# EAGLE design Timer PCB (EAGLE 6.5.0)
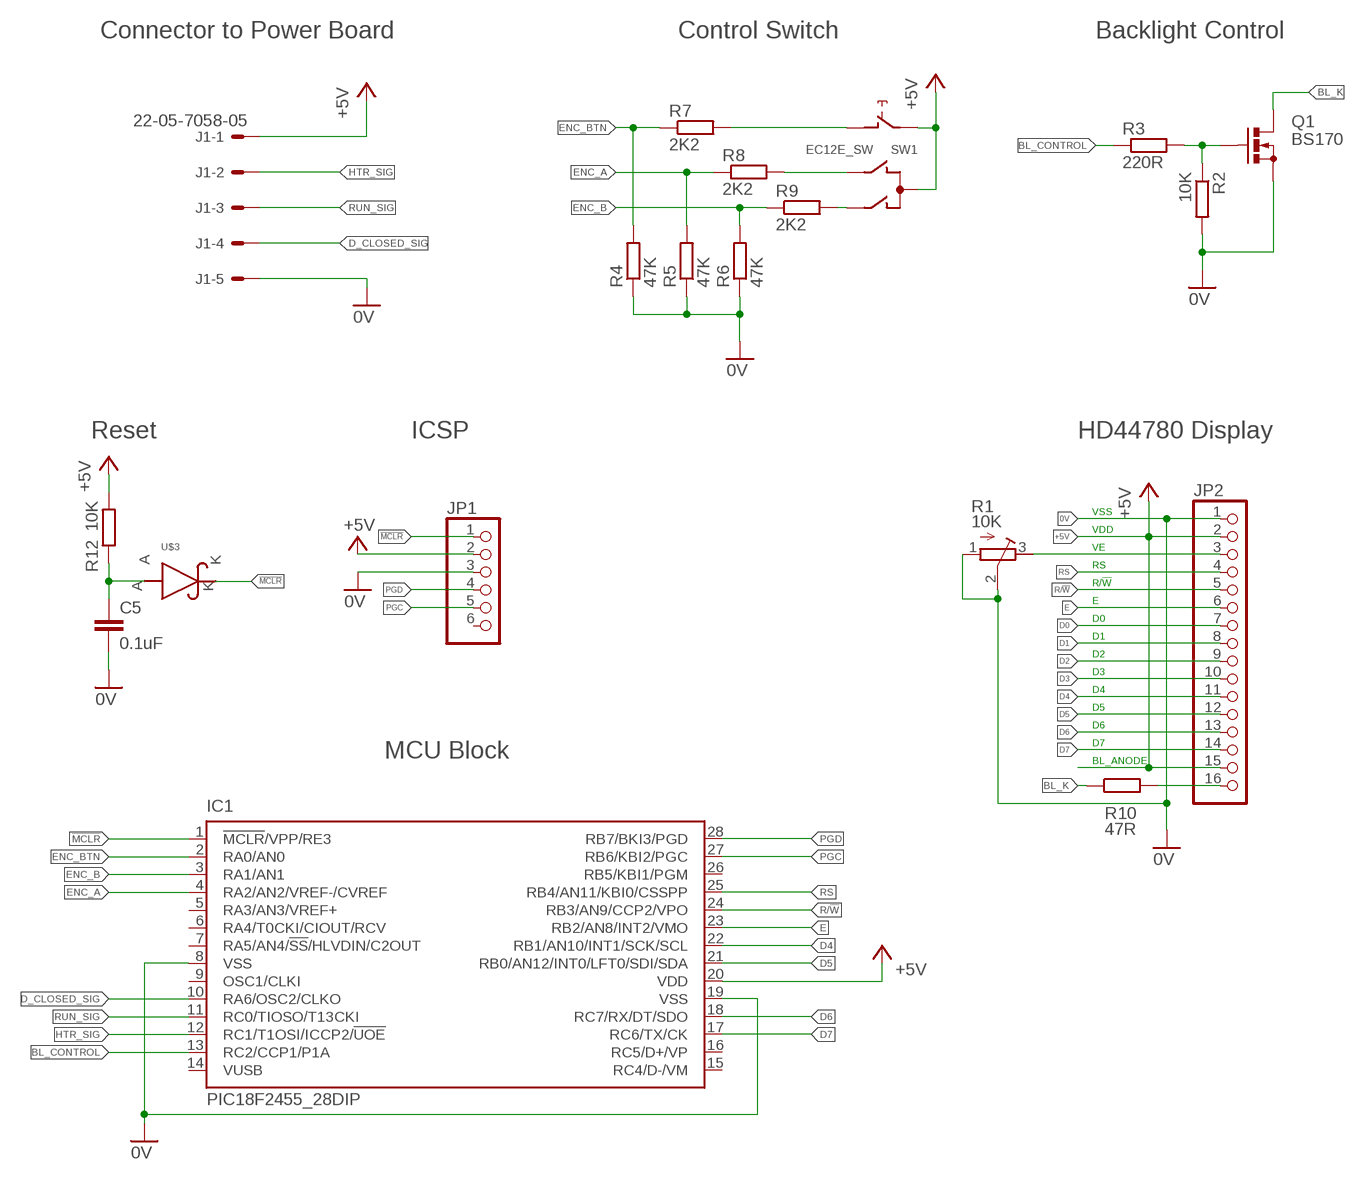
[diagram p0: schematic, sheet 1]

## Parts
C5  0.1uF  C-EUC0603  [C0603]
IC1  PIC18F2455_28DIP  [DIL28-3]
J1  22-05-7058-05  [7395-05]
JP1  PINHD-1X6/90  [1X06/90]
JP2  PINHD-1X16  [1X16]
Q1  BS170  [SOT54E]
R1  10K  R-TRIMM64W  [RTRIM64W]
R2  10K  R-EU_R0805  [R0805]
R3  220R  R-EU_R0805  [R0805]
R4  47K  R-EU_R0805  [R0805]
R5  47K  R-EU_R0805  [R0805]
R6  47K  R-EU_R0805  [R0805]
R7  2K2  R-EU_R0805  [R0805]
R8  2K2  R-EU_R0805  [R0805]
R9  2K2  R-EU_R0805  [R0805]
R10  47R  R-EU_0309/12  [0309/12]
R12  10K  R-EU_R0603  [R0603]
SW1  EC12E_SW  [ALPS_EC12E_SW]
U$3  ZHCS750  [SOT23]

## Nets
0V [power]: C5.2 IC1.8(VSS) IC1.19(VSS) J1.5 JP1.3 JP2.1 Q1.S R1.1(E) R1.2(S) R2.2 R4.1 R5.1 R6.1
!MCLR: IC1.1(!MCLR!/VPP/RE3) JP1.1 U$3.K
+5V [power]: IC1.20(VDD) J1.1 JP1.2 JP2.2 JP2.15 R12.2 SW1.C SW1.E
BL_CONTROL: IC1.13(RC2/CCP1/P1A) R3.1
BL_K [power]: Q1.D R10.1
D0: JP2.7
D1: JP2.8
D2: JP2.9
D3: JP2.10
D4: IC1.22(RB1/AN10/INT1/SCK/SCL) JP2.11
D5: IC1.21(RB0/AN12/INT0/LFT0/SDI/SDA) JP2.12
D6: IC1.18(RC7/RX/DT/SDO) JP2.13
D7: IC1.17(RC6/TX/CK) JP2.14
D_CLOSED_SIG: IC1.10(RA6/OSC2/CLKO) J1.4
E: IC1.23(RB2/AN8/INT2/VMO) JP2.6
ENC_A: IC1.4(RA2/AN2/VREF-/CVREF) R5.2 R8.1
ENC_B: IC1.3(RA1/AN1) R6.2 R9.1
ENC_BTN: IC1.2(RA0/AN0) R4.2 R7.1
HTR_SIG: IC1.12(RC1/T1OSI/ICCP2/!UOE) J1.2
N$1: Q1.G R2.1 R3.2
N$4 [power]: JP2.3 R1.3(A)
N$5: R8.2 SW1.B
N$6: R7.2 SW1.D
N$7: R9.2 SW1.A
N$9: JP2.16 R10.2
N$33: C5.1 R12.1 U$3.A
PGC: IC1.27(RB6/KBI2/PGC) JP1.5
PGD: IC1.28(RB7/BKI3/PGD) JP1.4
R/!W: IC1.24(RB3/AN9/CCP2/VPO) JP2.5
RS: IC1.25(RB4/AN11/KBI0/CSSPP) JP2.4
RUN_SIG: IC1.11(RC0/TIOSO/T13CKI) J1.3
Unconnected: IC1.5(RA3/AN3/VREF+) IC1.6(RA4/T0CKI/CIOUT/RCV) IC1.7(RA5/AN4/!SS!/HLVDIN/C2OUT) IC1.9(OSC1/CLKI) IC1.14(VUSB) IC1.15(RC4/D-/VM) IC1.16(RC5/D+/VP) IC1.26(RB5/KBI1/PGM) JP1.6 SW1.GND1(G) SW1.GND2(G)

## Notes on the sheet
- Connector to Power Board | Control Switch | Backlight Control
- Reset | ICSP | HD44780 Display
- VSS
- VDD
- VE
- RS
- R/!W
- E
- D0
- D1
- D2
- D3
- D4
- D5
- D6
- D7
- MCU Block
- BL_ANODE

## Library data of the parts
C5 = rcl:C-EU: CAPACITOR, European symbol
IC1 = microchip:PIC18F2*_28: USB Microcontrollers with nanoWatt Technology High-Performance, Enhanced Flash, 28/40/44-Pin, Source: http://ww1.microchip.com/downloads/en/devicedoc/39632c.pdf; MF: MICROCHIP; MPN: PIC18F2455-I/SP; OC_FARNELL: 1579600; OC_NEWARK: 01M8485
J1 = con-molex:22-?-05: CONNECTOR wire to board 2.54 mm (.1 inch) pitch header; OC_FARNELL: unknown; OC_NEWARK: unknown
JP1 = pinhead:PINHD-1X6: PIN HEADER
JP2 = pinhead:PINHD-1X16: PIN HEADER
Q1 = transistor-small-signal:BS170: N-CHANNEL MOS FET
R1 = rcl:R-TRIMM: Trimm resistor
R2-R10 R12 = rcl:R-EU_: RESISTOR, European symbol
SW1 = switch-alps:EC12E_SW: ALPS rotary Encoder EC12E series with switch; MPN: EC12E2424407; OC_FARNELL: 1520813; OC_NEWARK: 74M1068
U$3 = Duncs Diodes:ZHCS750: ZHCS750 750mA Schottky signal diode in a SOT-23 package. See datasheet for further information.

## Net classes
0 signal: width 0.406 mm, clearance 0.305 mm
1 power: width 1.016 mm, clearance 0.305 mm

## Board
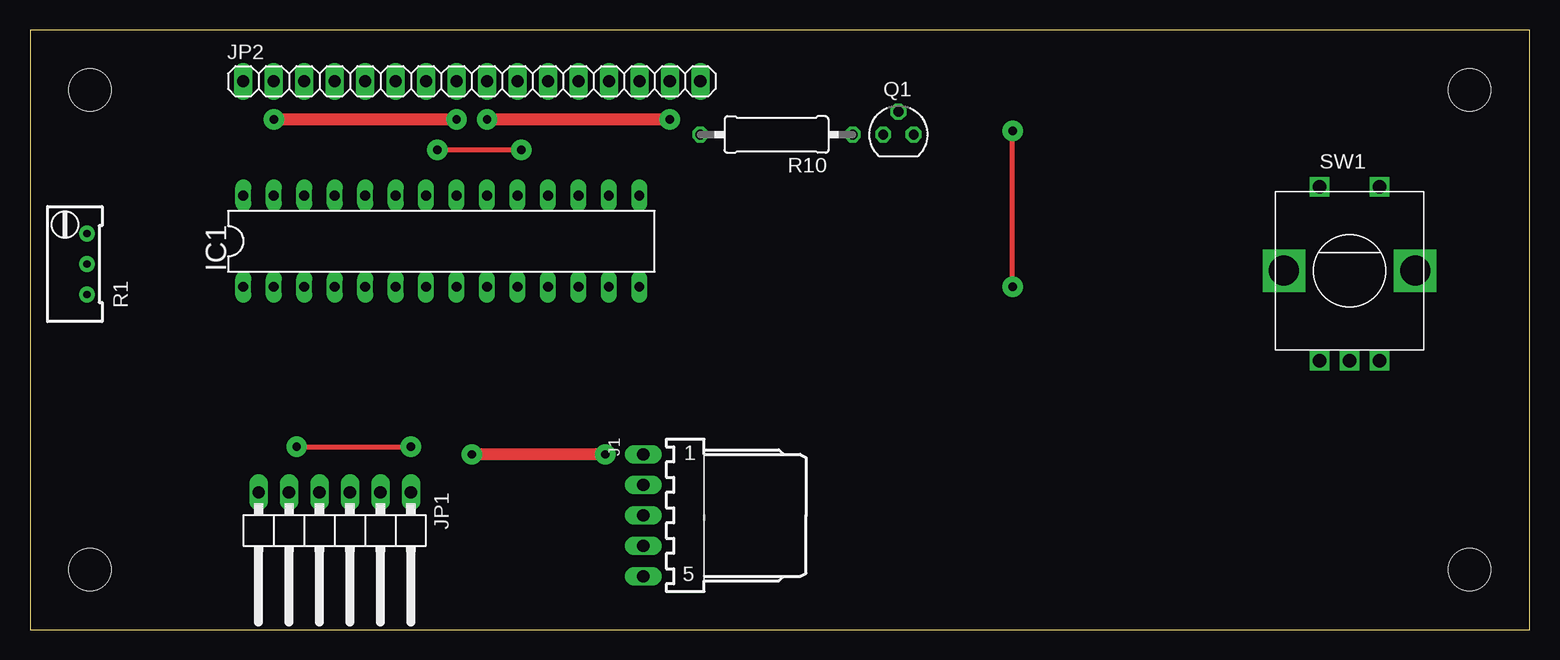
[diagram p1: board, top side]
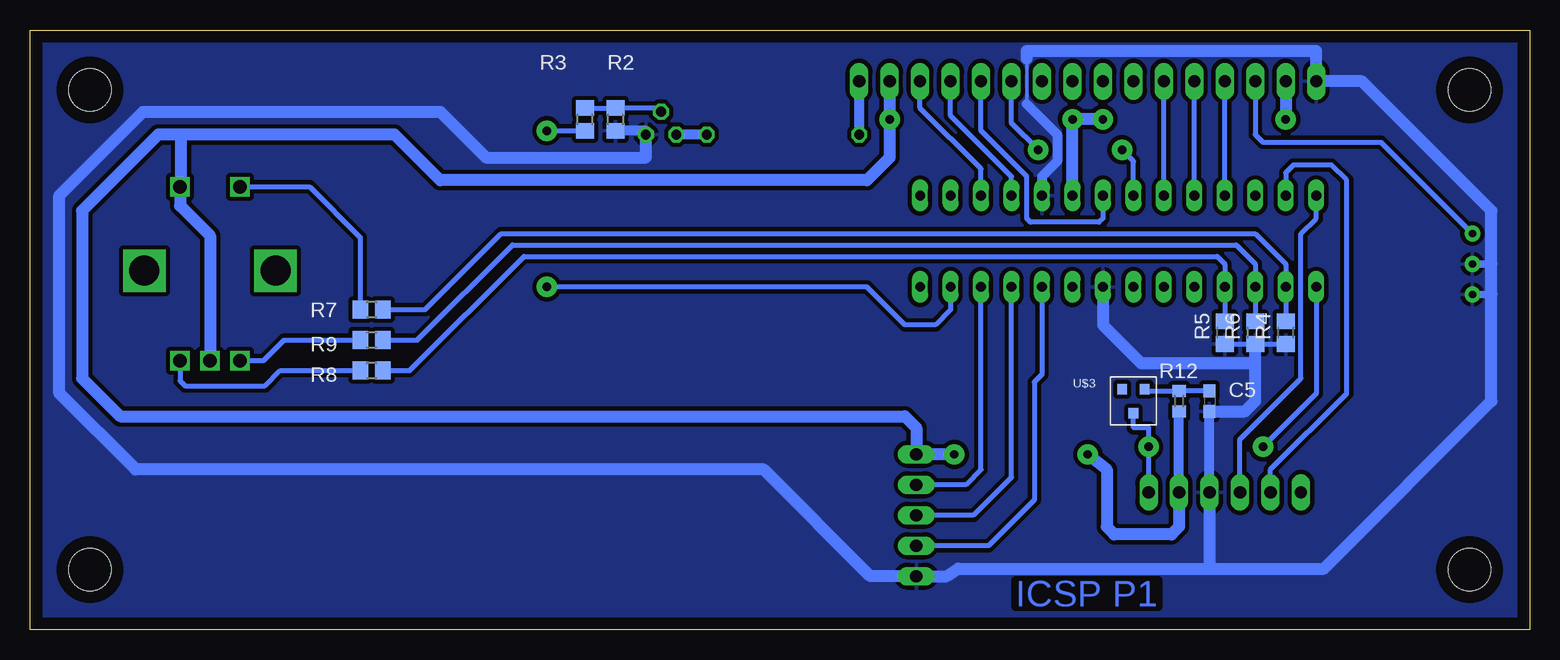
[diagram p2: board, bottom side, seen from below]

Size 125 x 50 mm. Coordinates in mm from the lower left corner, seen from the top.
Outline: 0,0 125,0 125,50 0,50 0,0
Copper layers (1*16): Top 0.035mm / dielectric 1.5mm / Bottom 0.035mm
Design rules "default *": minimum track width 10mil, minimum drill 24mil, track to track 8mil, track to pad 8mil, pad to pad 8mil, via to via 8mil, smd to smd 8mil, copper to edge 40mil, drill to drill 8mil, minimum pad ring 10mil, minimum via ring 8mil, stop-mask expansion 4mil, vias tented up to drill 0mil, thermal gap 14mil
Holes 3.5 mm at 5,5 120,5 5,45 120,45

### Footprints (pad centres in the part's own frame; a part is rotated, then mirrored left to right if it is on the bottom)
C0603 = smd 1.1 x 1: 1 -0.85,0; 2 0.85,0
DIL28-3 = drill 0.813 long: 1 -16.51,-3.81; 2 -13.97,-3.81; 3 -11.43,-3.81; 4 -8.89,-3.81; 5 -6.35,-3.81; 6 -3.81,-3.81; 7 -1.27,-3.81; 8 1.27,-3.81; 9 3.81,-3.81; 10 6.35,-3.81; 11 8.89,-3.81; 12 11.43,-3.81; 13 13.97,-3.81; 14 16.51,-3.81; 15 16.51,3.81; 16 13.97,3.81; 17 11.43,3.81; 18 8.89,3.81; 19 6.35,3.81; 20 3.81,3.81; 21 1.27,3.81; 22 -1.27,3.81; 23 -3.81,3.81; 24 -6.35,3.81; 25 -8.89,3.81; 26 -11.43,3.81; 27 -13.97,3.81; 28 -16.51,3.81
7395-05 = drill 1.016 long: 1 5.08,0; 2 2.54,0; 3 0,0; 4 -2.54,0; 5 -5.08,0
1X06/90 = drill 1.016 long: 1 -6.35,-3.81; 2 -3.81,-3.81; 3 -1.27,-3.81; 4 1.27,-3.81; 5 3.81,-3.81; 6 6.35,-3.81
1X16 = drill 1.016 long: 1 -19.05,0; 2 -16.51,0; 3 -13.97,0; 4 -11.43,0; 5 -8.89,0; 6 -6.35,0; 7 -3.81,0; 8 -1.27,0; 9 1.27,0; 10 3.81,0; 11 6.35,0; 12 8.89,0; 13 11.43,0; 14 13.97,0; 15 16.51,0; 16 19.05,0
SOT54E = drill 0.813 octagon: D -1.27,0; G 0,1.905; S 1.27,0
RTRIM64W = drill 0.61 pad 1.3: 1 1.27,-2.54; 2 1.27,0; 3 1.27,2.54
R0805 = smd 1.3 x 1.5: 1 -0.95,0; 2 0.95,0
0309/12 = drill 0.813 octagon: 1 -6.35,0; 2 6.35,0
R0603 = smd 1 x 1.1: 1 -0.85,0; 2 0.85,0
ALPS_EC12E_SW = drill 1.1 square: A -2.5,-7.5; B 2.5,-7.5; C 0,-7.5; D -2.5,7; E 2.5,7 | drill 2.5 square: GND1 -5.465,0; GND2 5.465,0
SOT23 = smd 0.8 x 0.9: A -0.95,-1; K 0,1; NC 0.95,-1

### Placement (x,y rotation side)
C5  26.67,19.05 270 bottom
IC1  34.29,32.38 0 top
J1  51.12,9.53 90 top
JP1  25.4,7.62 180 top
JP2  36.83,45.72 0 top
Q1  72.39,41.27 0 top
R1  3.49,30.48 0 top
R2  76.2,42.55 270 bottom
R3  78.74,42.55 90 bottom
R4  20.32,24.77 90 bottom
R5  25.4,24.77 90 bottom
R6  22.86,24.77 90 bottom
R7  96.52,26.67 180 bottom
R8  96.52,21.59 180 bottom
R9  96.52,24.13 180 bottom
R10  62.23,41.27 180 top
R12  29.21,19.05 270 bottom
SW1  110,29.92 0 top
U$3  33.02,19.05 180 bottom

### Tracks (layer width: path | path; a pad name or v marks a point on that pad's centre or on a via)
0V
  Bottom 0.305: 41.91,43.81 41.91,47.62
  Bottom 0.406: R5.1 R6.1 R4.1
  Bottom 0.61: R1.2 3.17,30.48 | R1.1 3.17,27.94
  Bottom 0.813: JP1.3 C5.2 | Q1.S 73.66,41.59 R2.2 | 41.91,43.81 39.37,41.27 39.37,39.05 40.64,37.78 IC1.19
  Bottom 1.016: 26.67,5.08 47.62,5.08 48.58,4.45 J1.5 54.93,4.45 63.82,13.34 116.2,13.34 122.56,19.68 122.56,36.2 115.57,43.18 90.81,43.18 87,39.37 73.66,39.37 Q1.S | 26.67,5.08 17.14,5.08 3.17,19.05 3.17,27.94 3.17,30.48 3.17,34.92 13.97,45.72 JP2.1 17.78,48.26 41.91,48.26 41.91,47.62 | C5.2 23.71,18.2 22.86,19.05 22.86,22.23 | 22.86,22.23 R6.1 | IC1.8 35.56,25.4 32.38,22.23 22.86,22.23 | JP1.3 26.67,5.08
  pour Bottom (isolate 0.356): -0.32,50.8 125.73,50.8 125.73,-0.95 -0.32,-0.95
!MCLR  (via drill 0.7 pad 1.7)
  Top 0.406: v22.23,15.24 v31.75,15.24
  Bottom 0.406: JP1.1 v31.75,15.24 31.75,16.83 33.02,16.83 U$3.K | IC1.1 17.78,19.68 v22.23,15.24
+5V  (via drill 0.7 pad 1.7)
  Top 1.016: v20.32,42.55 v35.56,42.55 | v38.1,42.55 v53.34,42.55 | v47.94,14.61 v36.83,14.61
  Bottom 0.813: JP1.2 R12.2
  Bottom 1.016: JP2.2 v20.32,42.55 | v35.56,42.55 v38.1,42.55 IC1.20 | JP1.2 29.21,8.57 29.84,7.94 34.61,7.94 35.24,8.57 35.24,13.34 v36.83,14.61 | 112.39,41.27 94.61,41.27 90.81,37.47 55.24,37.47 53.34,39.37 v53.34,42.55 JP2.15 | 112.39,41.27 114.3,41.27 120.65,34.92 120.65,20.95 117.47,17.78 52.07,17.78 51.12,16.83 J1.1 v47.94,14.61 | SW1.C 110,32.85 112.5,35.35 SW1.E 112.39,36.92 112.39,41.27
BL_CONTROL  (via drill 0.7 pad 1.7)
  Top 0.406: v81.92,28.57 v81.92,41.59
  Bottom 0.406: IC1.13 48.26,26.67 49.53,25.4 52.07,25.4 55.24,28.57 v81.92,28.57 | v81.92,41.59 81.59,41.59 R3.1
BL_K
  Bottom 0.813: R10.1 Q1.D
D4  (via drill 0.7 pad 1.7)
  Top 0.406: v33.97,40.01 v40.96,40.01
  Bottom 0.406: IC1.22 33.02,39.05 v33.97,40.01 | v40.96,40.01 43.18,42.23 JP2.11
D5
  Bottom 0.406: IC1.21 35.56,34.29 35.88,33.97 41.59,33.97 41.91,34.29 41.91,37.78 45.72,41.59 JP2.12
D6
  Bottom 0.406: IC1.18 43.18,37.78 48.26,42.86 JP2.13
D7
  Bottom 0.406: IC1.17 45.72,38.42 50.8,43.5 JP2.14
D_CLOSED_SIG
  Bottom 0.406: IC1.10 40.64,21.27 41.27,20.64 41.27,10.79 45.09,6.99 J1.4
E
  Bottom 0.406: IC1.23 JP2.6
ENC_A
  Bottom 0.406: R8.1 93.34,21.59 83.82,31.11 26.04,31.11 25.4,30.48 IC1.4 R5.2
ENC_B
  Bottom 0.406: R9.1 92.71,24.13 84.77,32.07 24.45,32.07 22.86,30.48 IC1.3 R6.2
ENC_BTN
  Bottom 0.406: R7.1 92.08,26.67 85.72,33.02 22.86,33.02 20.32,30.48 IC1.2 R4.2
HTR_SIG
  Bottom 0.406: IC1.12 45.72,13.34 46.99,12.06 J1.2
N$1
  Bottom 0.406: R3.2 R2.1 72.7,43.49 Q1.G
N$4
  Bottom 0.406: JP2.3 22.86,41.27 22.23,40.64 12.38,40.64 R1.3
N$5
  Bottom 0.406: SW1.B 112.5,20.74 112.08,20.32 105.41,20.32 104.14,21.59 R8.2
N$6
  Bottom 0.406: SW1.D 101.69,36.92 97.47,32.7 R7.2
N$7
  Bottom 0.406: R9.2 103.82,24.13 105.53,22.42 SW1.A
N$9
  Bottom 0.813: JP2.16 R10.2
N$33
  Bottom 0.406: C5.1 R12.1 32.07,19.9 U$3.A
PGC
  Bottom 0.406: JP1.5 21.59,13.34 15.24,19.68 15.24,37.47 16.51,38.73 19.68,38.73 20.32,38.1 IC1.27
PGD
  Bottom 0.406: JP1.4 24.13,15.88 19.05,20.95 19.05,33.02 17.78,34.29 IC1.28
R/!W
  Bottom 0.406: IC1.24 JP2.5
RS
  Bottom 0.406: IC1.25 JP2.4
RUN_SIG
  Bottom 0.406: IC1.11 43.18,12.7 46.35,9.53 J1.3

### Text on the board
Bottom: ICSP P1